# Altium project DongHoInternet.PrjPCB
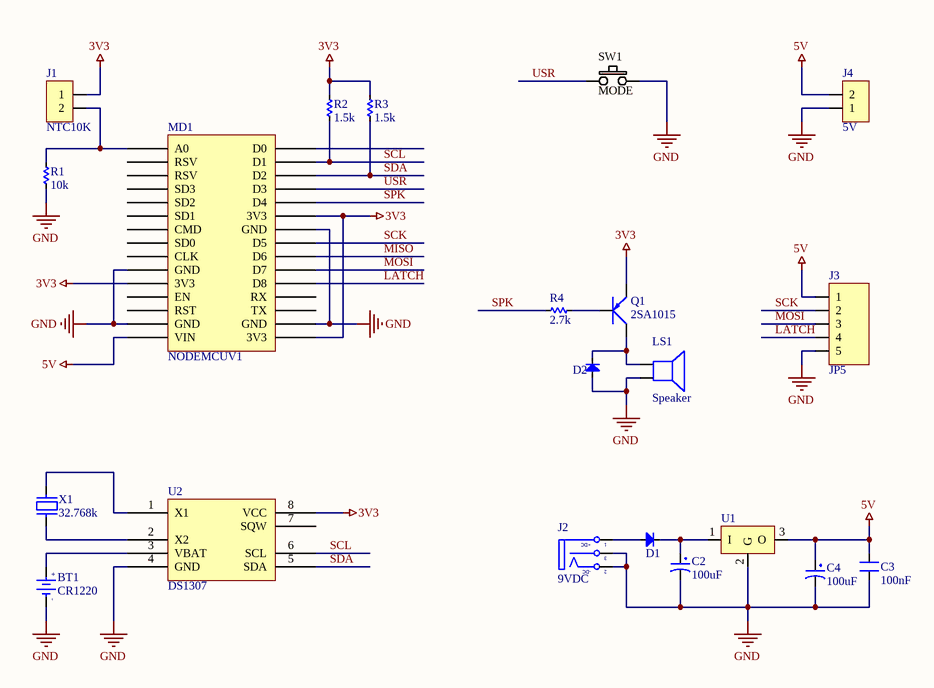
[diagram p0: DongHoInternet.SchDoc]
1 sheet, 21 parts. Net scope: global (net labels, ports and power ports of the same name join across sheets).
Board file: DongHoInternet.PcbDoc

## Sheet DongHoInternet.SchDoc
size A

### Parts
BT1  CR1220  [PIN CR1220]
C2  100uF  [TU TANTALUM]
C3  100nF  [CN-SMD-0805]
C4  100uF  [TU TANTALUM]
D1  Diode SMD  [DIO-SMD-106]  (value not drawn)
D2  Diode SMD  [DIO-SMD-106]  (value not drawn)
J1  NTC10K  [JP2-D1T]
J2  9VDC  [DC0]
J3  JP5  [JP5-D1C]
J4  5V  [JP2-D1C]
LS1  Speaker  [SPEAKER]
MD1  NODEMCUV1  [NODEMCUV1]
Q1  2SA1015  [SOT23-321]
R1  10k  [RES-SMD-0805]
R2  1.5k  [RES-SMD-0805]
R3  1.5k  [RES-SMD-0805]
R4  2.7k  [RES-SMD-0805]
SW1  MODE  [SW-OMRONRA-Y]
U1  LM78xx  [TO252-123]  (value not drawn)
U2  DS1307  [DS1307]
X1  32.768k  [XT32k]

### Nets
3V3: J1.1 MD1.3V3 Q1.1(E) R2.1 R3.1 U2.8(VCC)
5V: C3.2 C4.1 J3.1 J4.2 MD1.VIN U1.3(O)
GND: BT1.2(GND) C2.2 C3.1 C4.2 D2.1(A) J2.2(TN) J2.3(S) J3.5 J4.1 LS1.2 MD1.GND R1.2 SW1.1 U1.2(G) U2.4(GND)
LATCH: J3.4 MD1.D8
MISO: MD1.D6
MOSI: J3.3 MD1.D7
SCK: J3.2 MD1.D5
SCL: MD1.D1 R2.2 U2.6(SCL)
SDA: MD1.D2 R3.2 U2.5(SDA)
SPK: MD1.D4 R4.1
USR: MD1.D3 SW1.2
NetBT1_1: BT1.1(+3V) U2.3(VBAT)
NetC2_1: C2.1 D1.2(K) U1.1(I)
NetD1_1: D1.1(A) J2.1(T)
NetD2_2: D2.2(K) LS1.1 Q1.2(C)
NetJ1_2: J1.2 MD1.A0 R1.1
NetQ1_3: Q1.3(B) R4.2
NetU2_1: U2.1(X1) X1.2
NetU2_2: U2.2(X2) X1.1

Not connected (* = marked no-connect by the designer): MD1 CLK CMD D0 EN RST RSV RX SD0 SD1 SD2 SD3 TX; U2 7(SQW)

### Notes on the sheet
- (in symbol DCIN) +DC; -DC
- (in symbol PIN CR1220) +; -

### Library data of the parts
BT1 = PIN CR1220
C2 C4 = CAP TANTALUM
C3 = CN: Value: 33pF
D1 D2 = Diode SMD: Default Diode; Code - JEDEC: DO-214-AB; Value: 1N5007; Published: 8-Jun-2000; Revision: July-2002: Re-released for DXP Platform.; Publisher: Altium Limited
J1 J4 = JP2: WR-PHD 2.54 mm Angled Socket Header; Manufacturer: W¨¹rth Elektronik eiSos GmbH; partNo: 613002143121; ComponentLink1 Description: Manufacturer; ComponentLink2 Description: Datasheet; NoPins: 02; Created Date: 29 March 2013; ComponentLink1URL: http://www.we-online.com; ComponentLink2URL: http://katalog.we-online.de/em/datasheet/6130xx143121.pdf; Created by: Karrer Zheng
J2 = DCIN: Jac DC input; Value: Jac DC
J3 = JP5: WR-PHD 2.54 mm Angled Socket Header; Manufacturer: W¨¹rth Elektronik eiSos GmbH; partNo: 613005143121; ComponentLink1 Description: Manufacturer; ComponentLink2 Description: Datasheet; NoPins: 05; Created Date: 29 March 2013; ComponentLink1URL: http://www.we-online.com; ComponentLink2URL: http://katalog.we-online.de/em/datasheet/6130xx143121.pdf; Created by: Karrer Zheng
LS1 = Speaker: Loudspeaker; Published: 24-Mar-1999; LatestRevisionDate: 17-Jul-2002; LatestRevisionNote: Re-released for DXP Platform.; PackageReference: PIN2; Publisher: Altium Limited
Q1 = 2SA1015: PNP 600mW, ECB; Value: A1015
R1-R4 = Res-SMD: Resistor; Manufacturer: Generic Components; Class: Passive; Published: 08/06/2000; Publisher: Altium Hobart Technology Centre
SW1 = SW-PB-YELLOW-RA: SW-D6-R / SW-DS-S / SW-14X14 / SW-7X7
U1 = LM78xx: Positive Voltage Regulator; Note: Tab is connected to pin 3 (GND).; Published: 24-Aug-2001; LatestRevisionDate: 17-Jul-2002; LatestRevisionNote: Re-released for DXP Platform.; DatasheetVersion: Apr-1994; PackageVersion: Jul-1998; PackageReference: ISOWATT220AB; Publisher: Altium Limited; PackageDescription: TO, Thru-Hole, Vertical, Heatsink Mounted; 3 In-Line Leads; Pitch 2.54 mm; Pin sequence 1, 3, 2; ComponentLink1Description: Manufacturer Link; ComponentLink1URL: http://www.st.com/; ComponentLink2Description: Datasheet; ComponentLink2URL: http://www.st.com/stonline/products/literature/ds/2146/l78m05c.pdf
X1 = XT2: Crystal, 32.768 KHz, -40 to 85 degC, 3.2 x 1.5 x 0.9 mm SMD; Value: 4Mhz